# Altium project RS232V2.0.PrjPcb
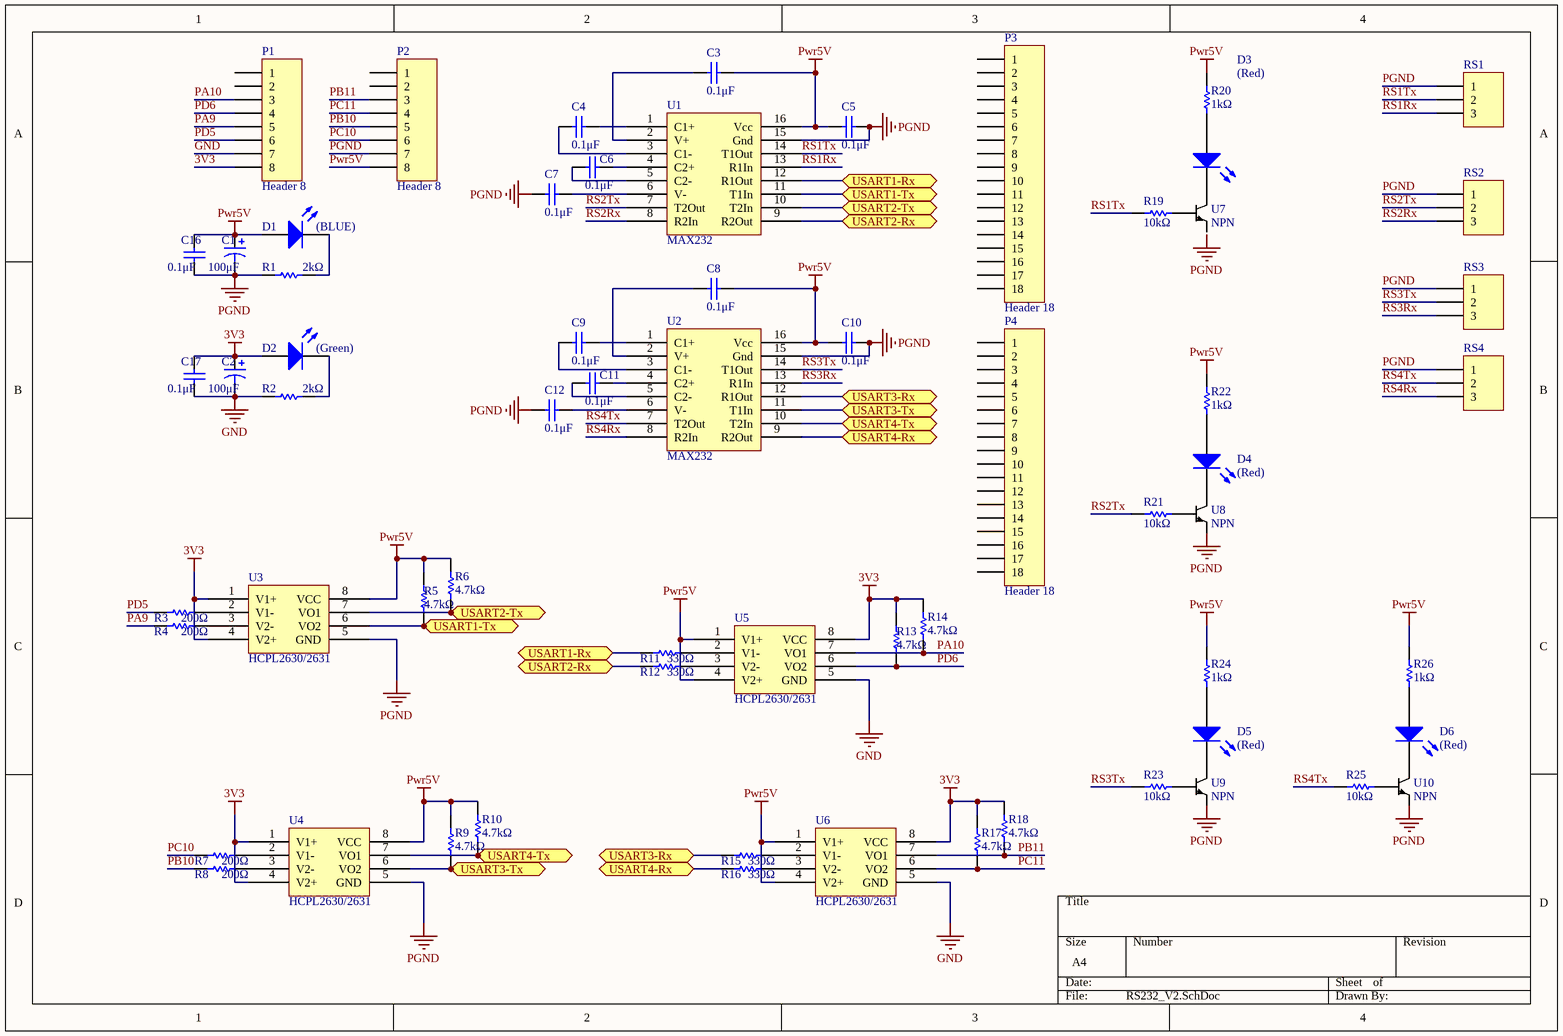
[diagram p0: RS232_V2.SchDoc]
1 sheet, 64 parts. Net scope: flat (ports and power ports of the same name join across sheets).
Board file: RS232_V2.PcbDoc

## Sheet RS232_V2.SchDoc
size A4

### Parts
C1  value 100μF  [CAP-TAN-6032/CAPC]  (hidden comment: CAP-TAN)
C2  value 100μF  [CAP-TAN-6032/CAPC]  (hidden comment: CAP-TAN)
C3  0.1μF  [CAP-MLCC-0603]
C4  0.1μF  [CAP-MLCC-0603]
C5  0.1μF  [CAP-MLCC-0603]
C6  0.1μF  [CAP-MLCC-0603]
C7  0.1μF  [CAP-MLCC-0603]
C8  0.1μF  [CAP-MLCC-0603]
C9  0.1μF  [CAP-MLCC-0603]
C10  0.1μF  [CAP-MLCC-0603]
C11  0.1μF  [CAP-MLCC-0603]
C12  0.1μF  [CAP-MLCC-0603]
C16  0.1μF  [CAP-MLCC-0603]
C17  0.1μF  [CAP-MLCC-0603]
D1  value (BLUE)  [LED-0805]  (hidden comment: LED)
D2  value (Green)  [LED-0805]  (hidden comment: LED)
D3  (Red)  [LED-0805]
D4  (Red)  [LED-0805]
D5  (Red)  [LED-0805]
D6  (Red)  [LED-0805]
P1  Header 8  [SIP8]
P2  Header 8  [SIP8]
P3  Header 18  [SIP18]
P4  Header 18  [SIP18]
R1  value 2kΩ  [RES-0603]  (hidden comment: RES)
R2  value 2kΩ  [RES-0603]  (hidden comment: RES)
R3  200Ω  [RES-0603]
R4  200Ω  [RES-0603]
R5  4.7kΩ  [RES-0603]
R6  4.7kΩ  [RES-0603]
R7  200Ω  [RES-0603]
R8  200Ω  [RES-0603]
R9  4.7kΩ  [RES-0603]
R10  4.7kΩ  [RES-0603]
R11  330Ω  [RES-0603]
R12  330Ω  [RES-0603]
R13  4.7kΩ  [RES-0603]
R14  4.7kΩ  [RES-0603]
R15  330Ω  [RES-0603]
R16  330Ω  [RES-0603]
R17  4.7kΩ  [RES-0603]
R18  4.7kΩ  [RES-0603]
R19  10kΩ  [RES-0603]
R20  1kΩ  [RES-0603]
R21  10kΩ  [RES-0603]
R22  1kΩ  [RES-0603]
R23  10kΩ  [RES-0603]
R24  1kΩ  [RES-0603]
R25  10kΩ  [RES-0603]
R26  1kΩ  [RES-0603]
RS1  Header 3  [Green_3P]  (value not drawn)
RS2  Header 3  [Green_3P]  (value not drawn)
RS3  Header 3  [Green_3P]  (value not drawn)
RS4  Header 3  [Green_3P]  (value not drawn)
U1  MAX232  [SOIC16]
U2  MAX232  [SOIC16]
U3  HCPL2630/2631  [SOP8]
U4  HCPL2630/2631  [SOP8]
U5  HCPL2630/2631  [SOP8]
U6  HCPL2630/2631  [SOP8]
U7  NPN  [SOT-23]
U8  NPN  [SOT-23]
U9  NPN  [SOT-23]
U10  NPN  [SOT-23]

### Ports
USART1-Rx, USART1-Tx, USART2-Rx, USART2-Tx, USART3-Rx, USART3-Tx, USART4-Rx, USART4-Tx

### Nets
3V3: C2.1 C17.1 D2.1(A) P1.8 R13.2 R14.2 R17.2 R18.2 U3.1(V1+) U3.4(V2+) U4.1(V1+) U4.4(V2+) U5.8(VCC) U6.8(VCC)
GND: C2.2 C17.2 P1.7 R2.1 U5.5(GND) U6.5(GND)
PGND: C1.2 C5.2 C7.1 C10.2 C12.1 C16.1 P2.7 R1.1 RS1.1 RS2.1 RS3.1 RS4.1 U1.15(Gnd) U2.15(Gnd) U3.5(GND) U4.5(GND) U8.2(E) U9.2(E) U10.2(E)
Pwr5V: C1.1 C3.2 C5.1 C8.2 C10.1 C16.2 D1.1(A) P2.8 R5.2 R6.2 R9.2 R10.2 R20.2 R22.2 R24.2 R26.2 U1.16(Vcc) U2.16(Vcc) U3.8(VCC) U4.8(VCC) U5.1(V1+) U5.4(V2+) U6.1(V1+) U6.4(V2+)
PA9: P1.5 R4.1
PA10: P1.3 R14.1 U5.7(VO1)
PB10: P2.5 R8.1
PB11: P2.3 R18.1 U6.7(VO1)
PC10: P2.6 R7.1
PC11: P2.4 R17.1 U6.6(VO2)
PD5: P1.6 R3.1
PD6: P1.4 R13.1 U5.6(VO2)
RS1Rx: RS1.3 U1.13(R1In)
RS1Tx: R19.1 RS1.2 U1.14(T1Out)
RS2Rx: RS2.3 U1.8(R2In)
RS2Tx: R21.1 RS2.2 U1.7(T2Out)
RS3Rx: RS3.3 U2.13(R1In)
RS3Tx: R23.1 RS3.2 U2.14(T1Out)
RS4Rx: RS4.3 U2.8(R2In)
RS4Tx: R25.1 RS4.2 U2.7(T2Out)
NetC3_1: C3.1 U1.2(V+)
NetC4_1: C4.1 U1.3(C1-)
NetC4_2: C4.2 U1.1(C1+)
NetC6_1: C6.1 U1.5(C2-)
NetC6_2: C6.2 U1.4(C2+)
NetC7_2: C7.2 U1.6(V-)
NetC8_1: C8.1 U2.2(V+)
NetC9_1: C9.1 U2.3(C1-)
NetC9_2: C9.2 U2.1(C1+)
NetC11_1: C11.1 U2.5(C2-)
NetC11_2: C11.2 U2.4(C2+)
NetC12_2: C12.2 U2.6(V-)
NetD1_2: D1.2(K) R1.2
NetD2_2: D2.2(K) R2.2
NetD3_1: D3.1(A) R20.1
NetD3_2: D3.2(K) U7.3(C)
NetD4_1: D4.1(A) R22.1
NetD4_2: D4.2(K) U8.3(C)
NetD5_1: D5.1(A) R24.1
NetD5_2: D5.2(K) U9.3(C)
NetD6_1: D6.1(A) R26.1
NetD6_2: D6.2(K) U10.3(C)
NetR3_2: R3.2 U3.2(V1-)
NetR4_2: R4.2 U3.3(V2-)
NetR5_1: R5.1 U1.11(T1In) U3.6(VO2) ; port USART1-Tx
NetR6_1: R6.1 U1.10(T2In) U3.7(VO1) ; port USART2-Tx
NetR7_2: R7.2 U4.2(V1-)
NetR8_2: R8.2 U4.3(V2-)
NetR9_1: R9.1 U2.11(T1In) U4.6(VO2) ; port USART3-Tx
NetR10_1: R10.1 U2.10(T2In) U4.7(VO1) ; port USART4-Tx
NetR11_1: R11.1 U1.12(R1Out) ; port USART1-Rx
NetR11_2: R11.2 U5.2(V1-)
NetR12_1: R12.1 U1.9(R2Out) ; port USART2-Rx
NetR12_2: R12.2 U5.3(V2-)
NetR15_1: R15.1 U2.12(R1Out) ; port USART3-Rx
NetR15_2: R15.2 U6.2(V1-)
NetR16_1: R16.1 U2.9(R2Out) ; port USART4-Rx
NetR16_2: R16.2 U6.3(V2-)
NetR19_2: R19.2 U7.1(B)
NetR21_2: R21.2 U8.1(B)
NetR23_2: R23.2 U9.1(B)
NetR25_2: R25.2 U10.1(B)

Not connected (* = marked no-connect by the designer): P1 1 2; P2 1 2; P3 1 2 3 4 5 6 7 8 9 10 11 12 13 14 15 16 17 18; P4 1 2 3 4 5 6 7 8 9 10 11 12 13 14 15 16 17 18; U7 2(E)

### Notes on the sheet
- Labels drawn without touching a wire or pin: PGND

### Library data of the parts
C1 C2 = CAP-TAN: 钽电容; Published: 8-Jun-2000; LatestRevisionDate: 17-Jul-2002; LatestRevisionNote: Re-released for DXP Platform.; PackageReference: POLAR0.8; Publisher: Altium Limited; PackageDescription: Polarized Capacitor; 2 Leads
C3-C12 C16 C17 = CAP: 无极性电容; Value: *μF; Published: 8-Jun-2000; LatestRevisionDate: 17-Jul-2002; LatestRevisionNote: Re-released for DXP Platform.; PackageReference: RAD-0.3; Publisher: Altium Limited; PackageDescription: Radial Cap, Thru-Hole; 2 Leads; 0.3 in Pin Spacing
D3-D6 = LED: Published: 8-Jun-2000; LatestRevisionDate: 08-Jul-2005; LatestRevisionNote: Mech Layer 1 removed.; PackageReference: LED-1; Publisher: Altium Limited; PackageDescription: LED; 2 Leads; Value: (Red)
P1 P2 = Header 8: Header, 8-Pin; LatestRevisionDate: 17-Jul-2002; LatestRevisionNote: Re-released for DXP Platform.; Publisher: Altium Limited
P3 P4 = Header 18: Header, 18-Pin; LatestRevisionDate: 17-Jul-2002; LatestRevisionNote: Re-released for DXP Platform.; Publisher: Altium Limited
R1 R2 = RES: 电阻; Published: 8-Jun-2000; LatestRevisionDate: 17-Jul-2002; LatestRevisionNote: Re-released for DXP Platform.; PackageReference: AXIAL-0.3; Publisher: Altium Limited; PackageDescription: Axial Device, Thru-Hole; 2 Leads; 0.3 in Pin Spacing
R3-R26 = RES: 电阻; Value: *kΩ; Published: 8-Jun-2000; LatestRevisionDate: 17-Jul-2002; LatestRevisionNote: Re-released for DXP Platform.; PackageReference: AXIAL-0.3; Publisher: Altium Limited; PackageDescription: Axial Device, Thru-Hole; 2 Leads; 0.3 in Pin Spacing
RS1-RS4 = Header 3: Header, 3-Pin; LatestRevisionDate: 17-Jul-2002; LatestRevisionNote: Re-released for DXP Platform.; Publisher: Altium Limited
U1 U2 = IC-MAX232
U7-U10 = NPN三极管
D1 D2 = LED: Published: 8-Jun-2000; LatestRevisionDate: 08-Jul-2005; LatestRevisionNote: Mech Layer 1 removed.; PackageReference: LED-1; Publisher: Altium Limited; PackageDescription: LED; 2 Leads